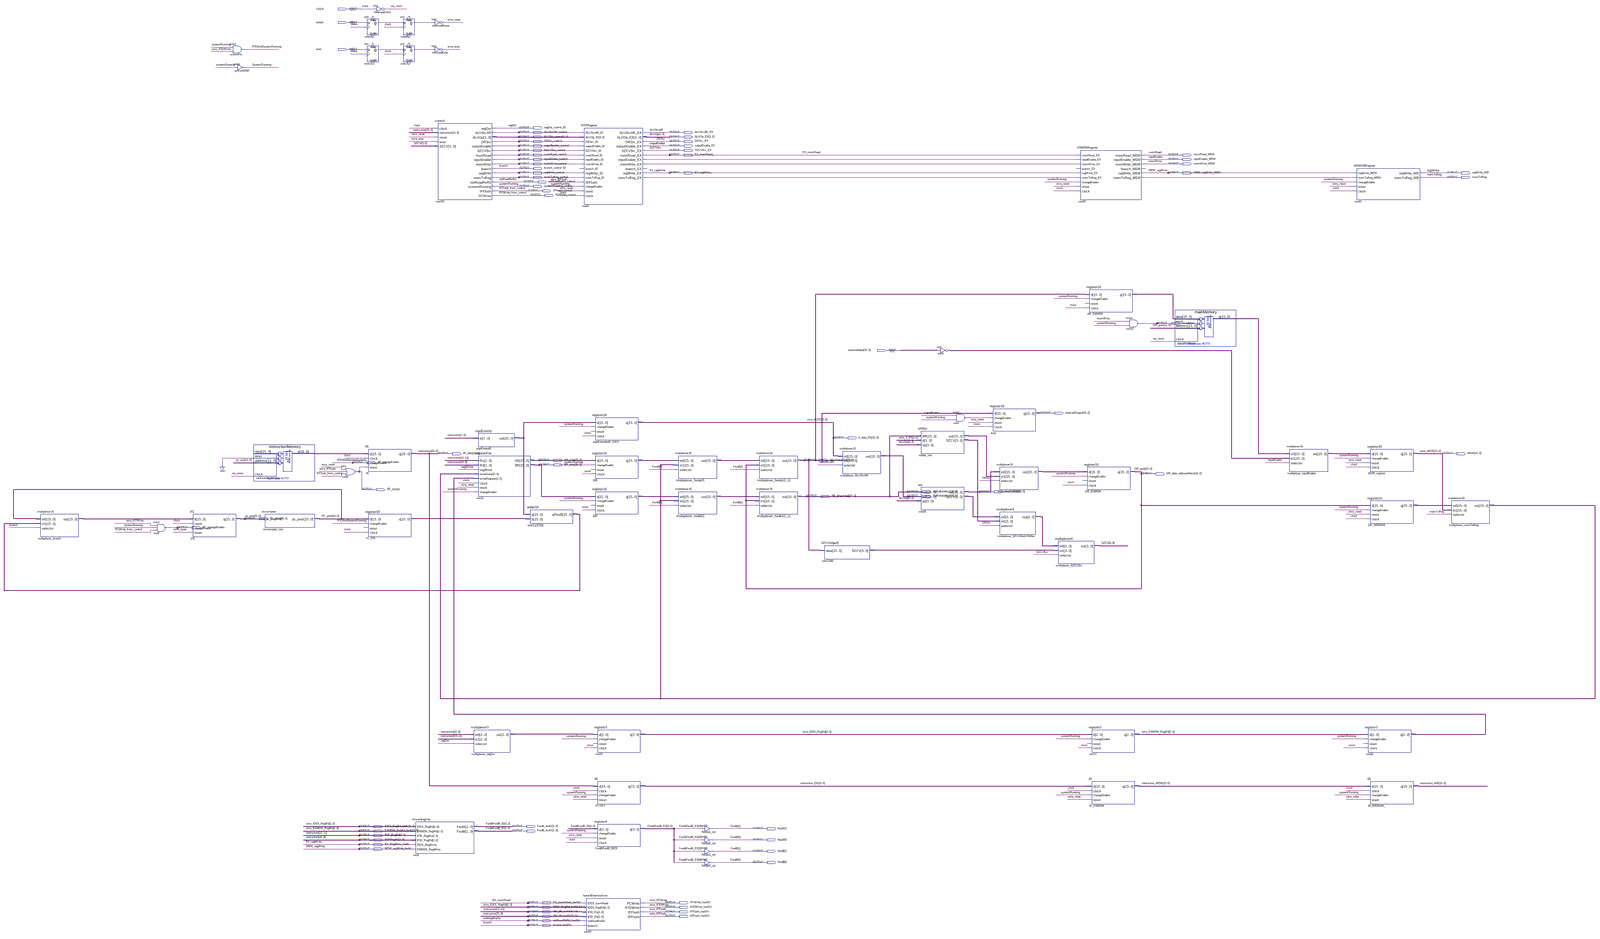
[diagram p0: schematic sheet, whole]
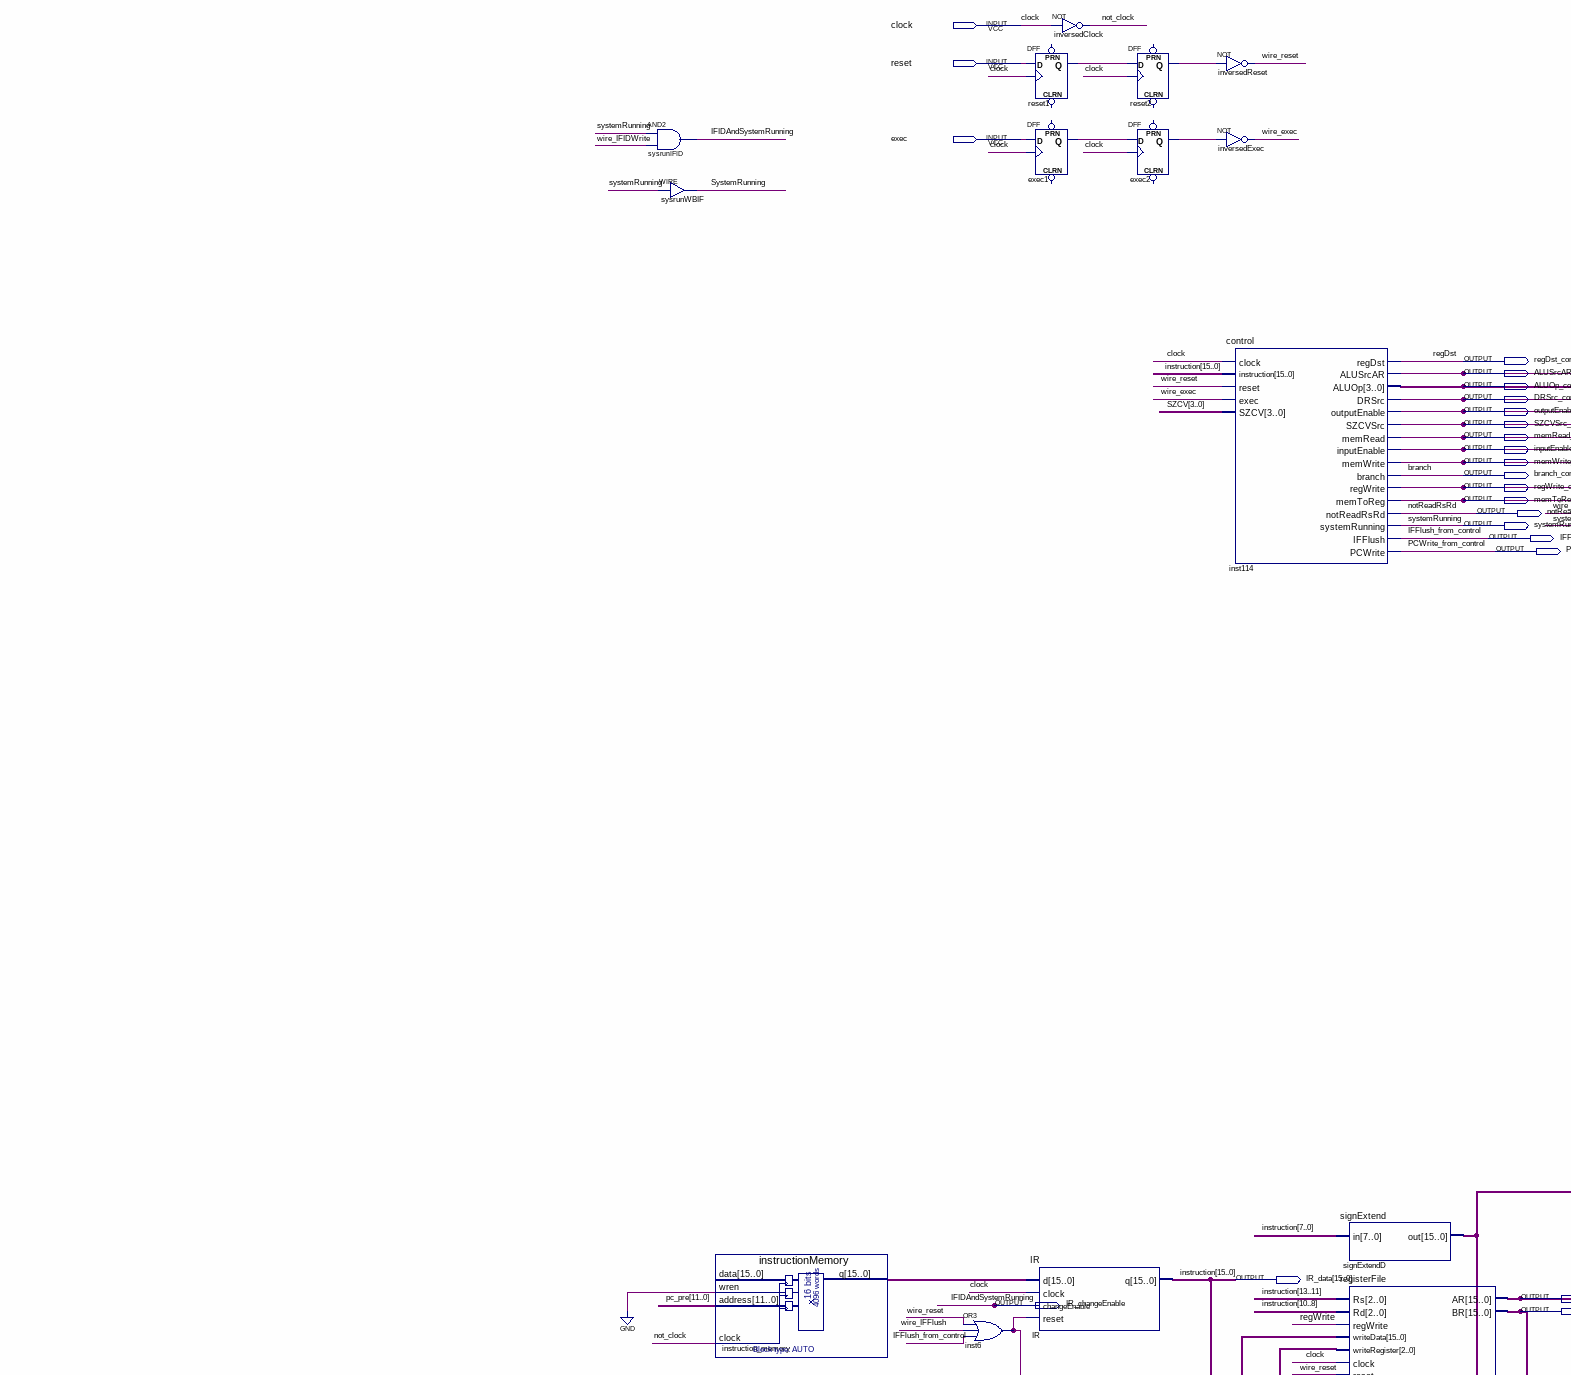
[diagram p1: schematic sheet, upper left part]
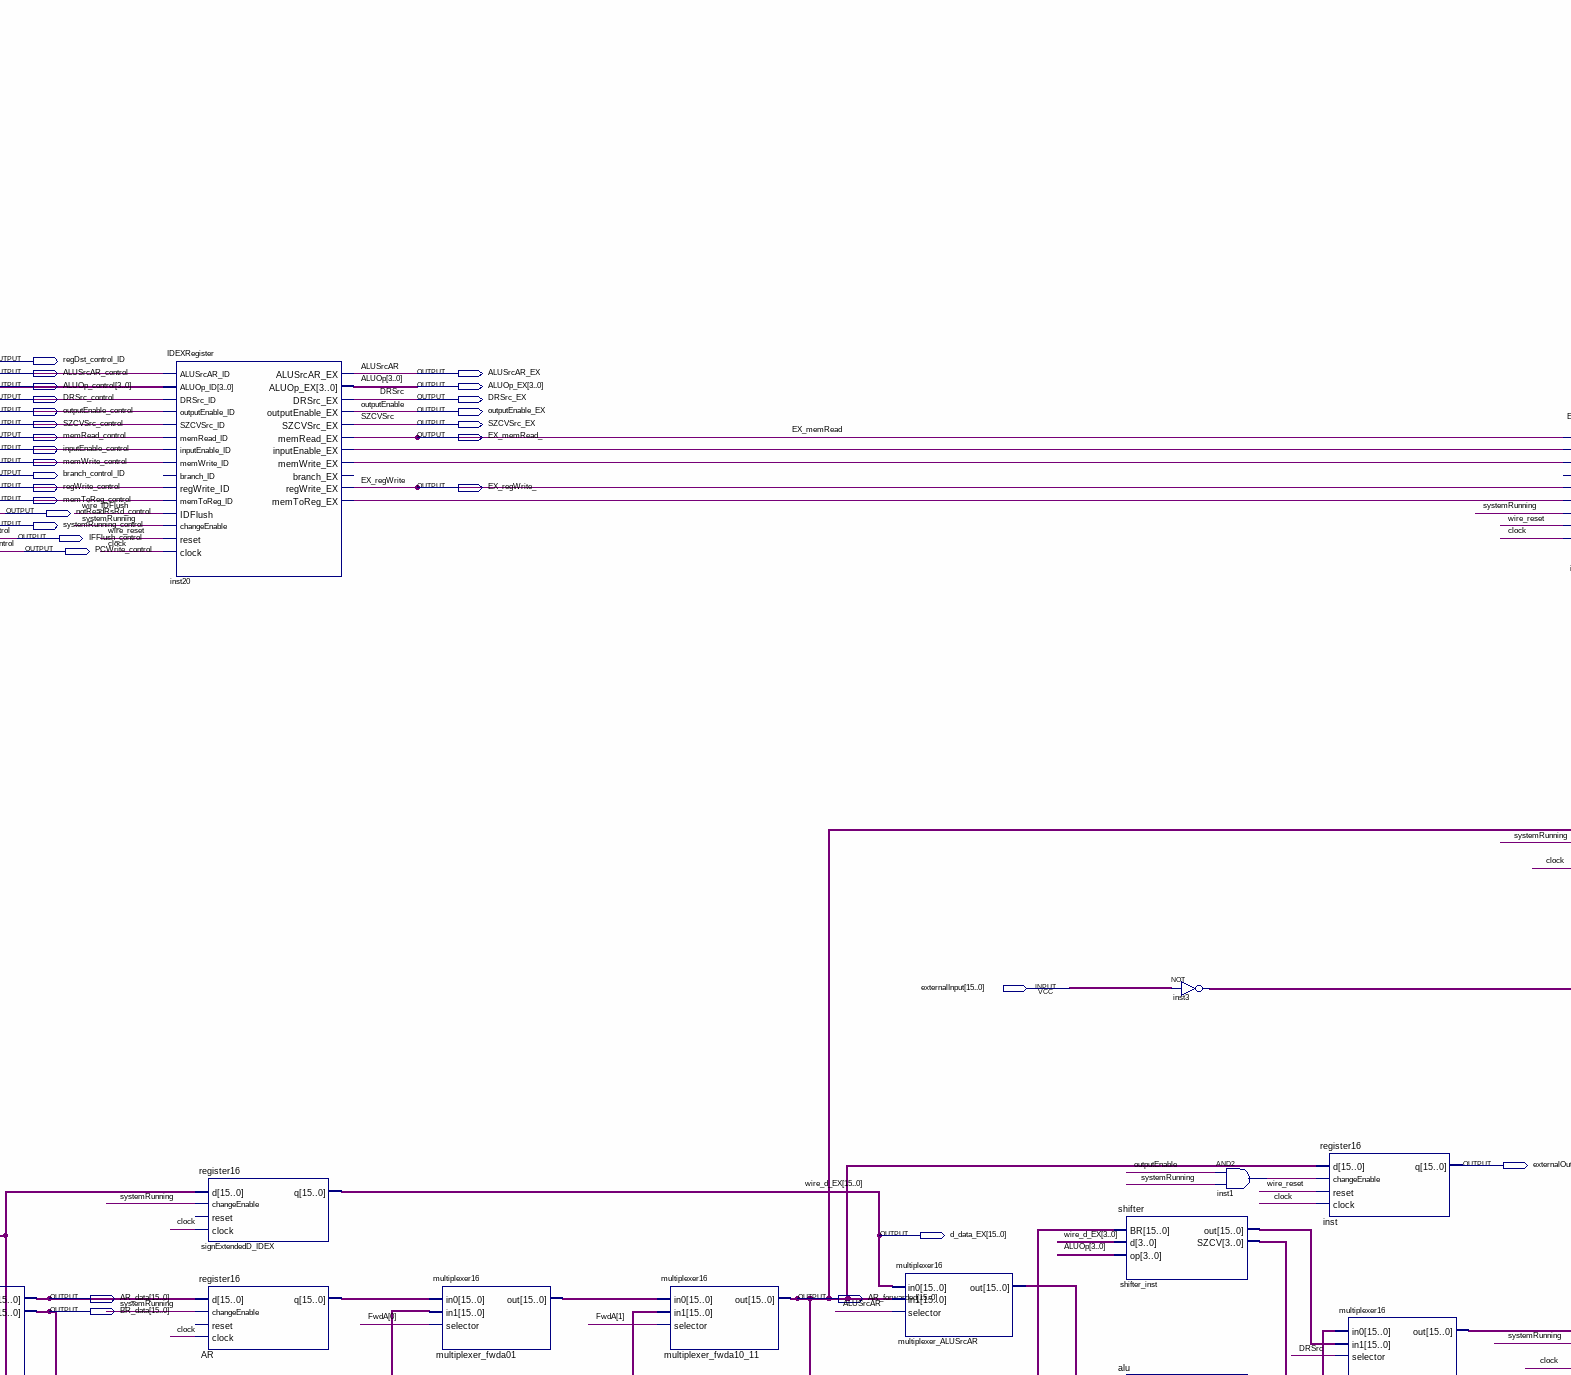
[diagram p2: schematic sheet, upper centre part]
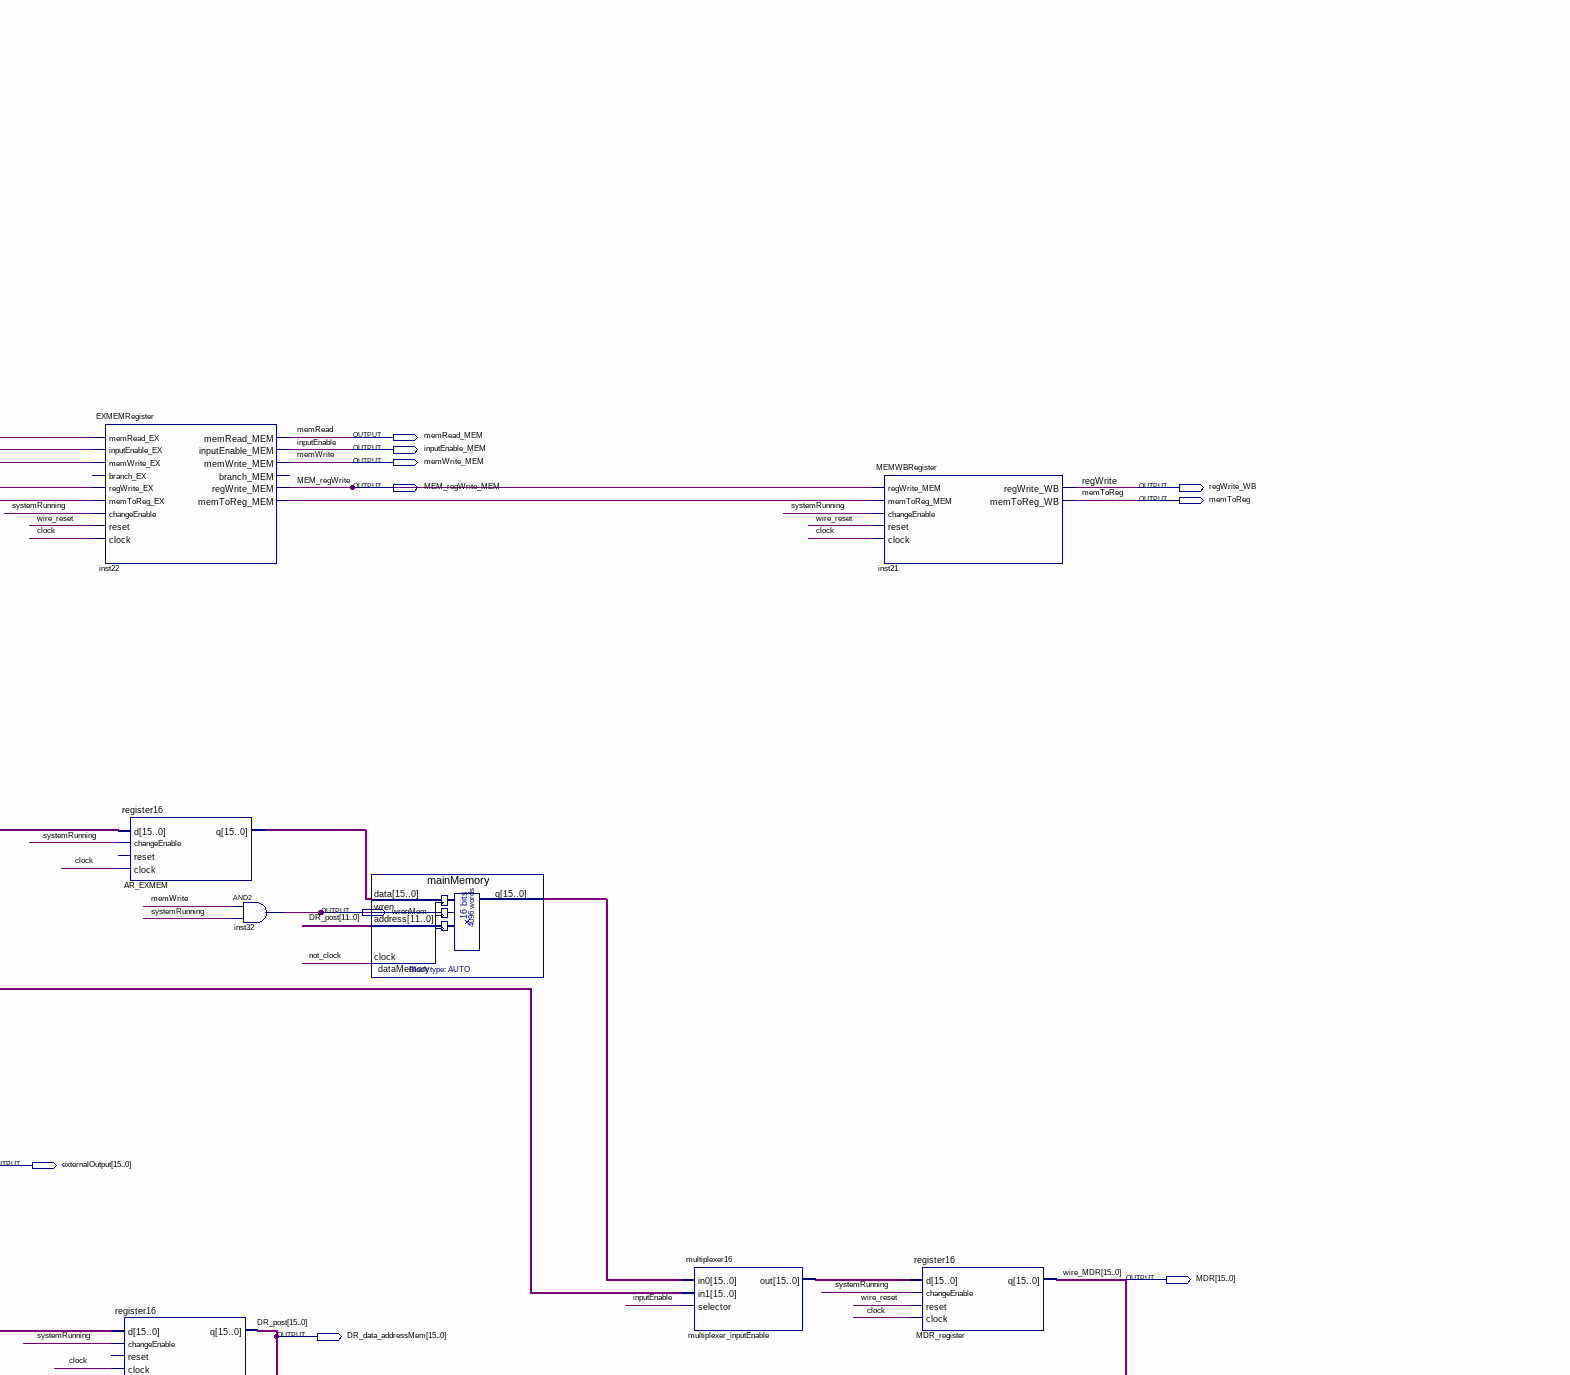
[diagram p3: schematic sheet, upper right part]
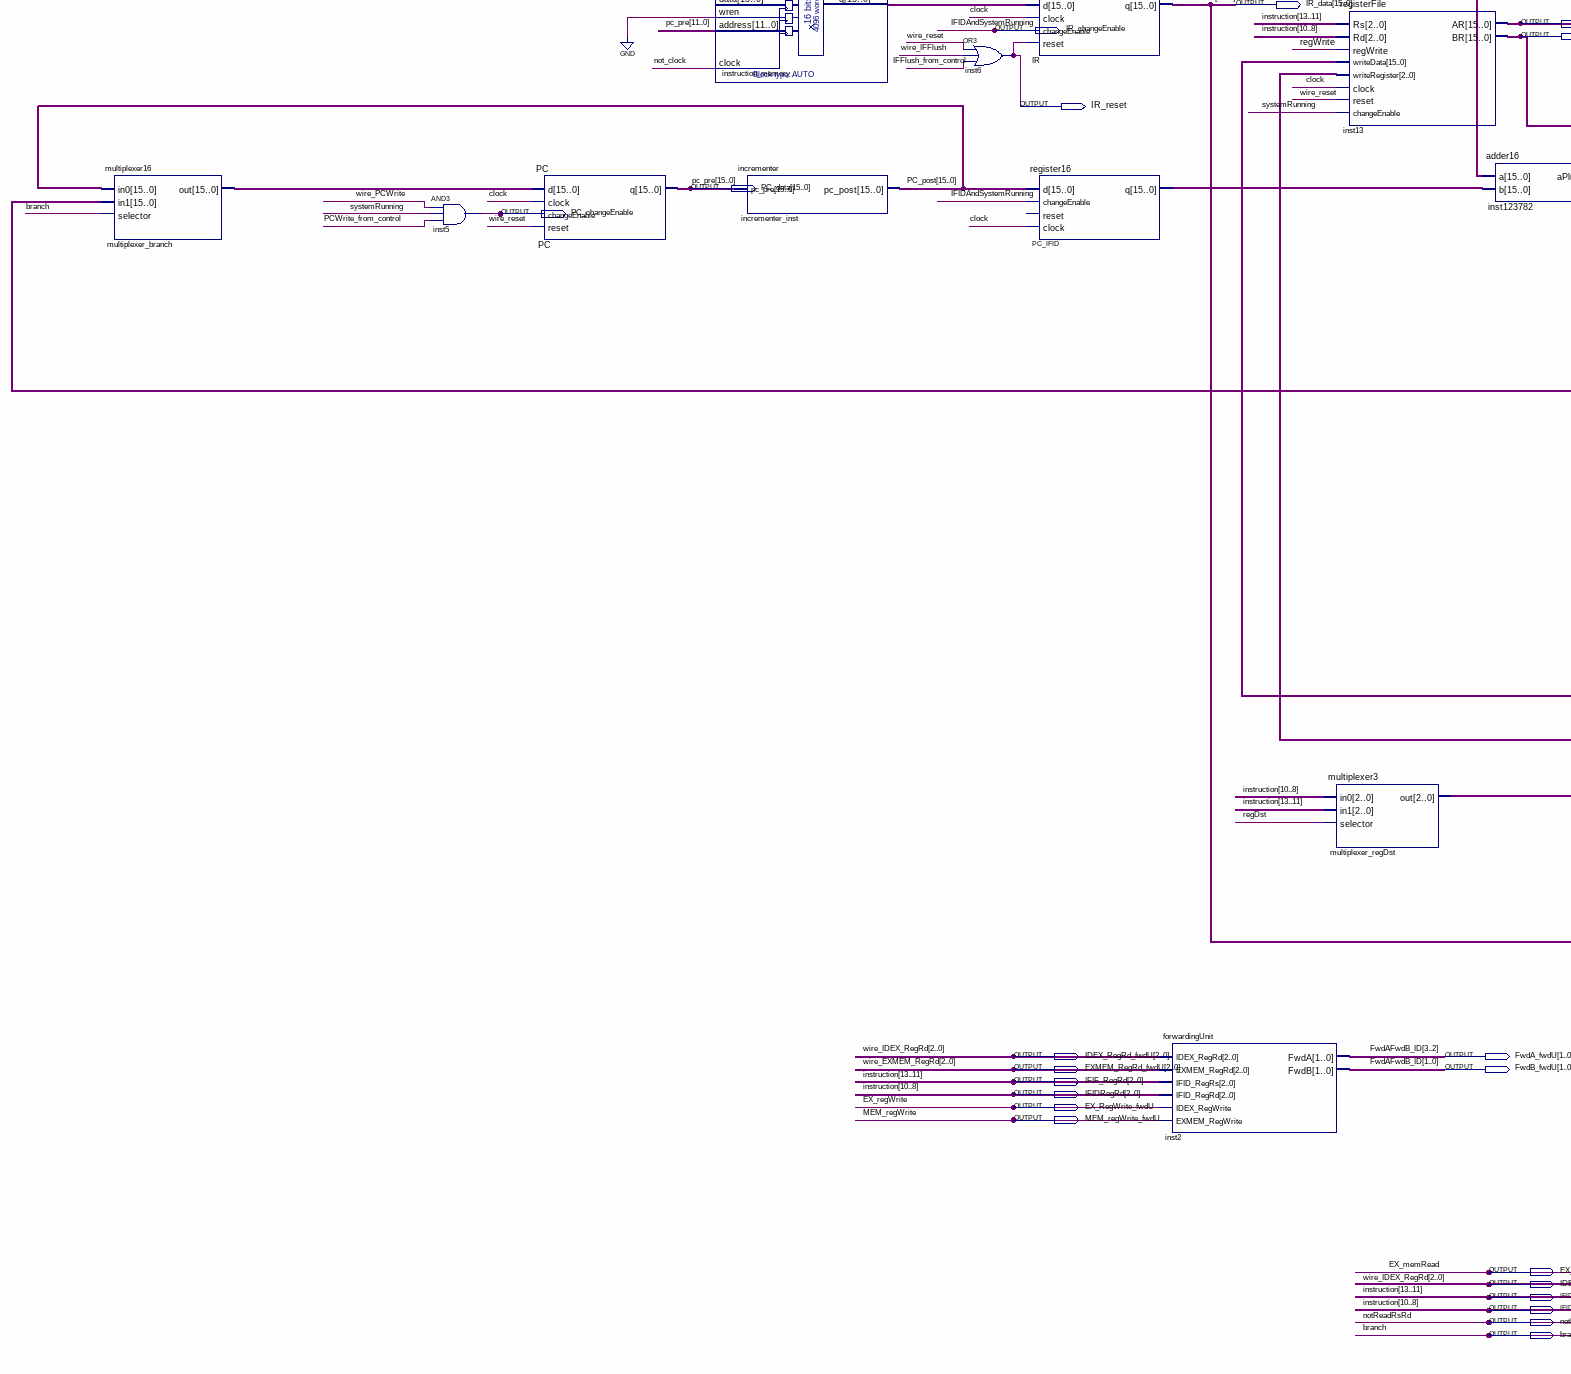
[diagram p4: schematic sheet, lower left part]
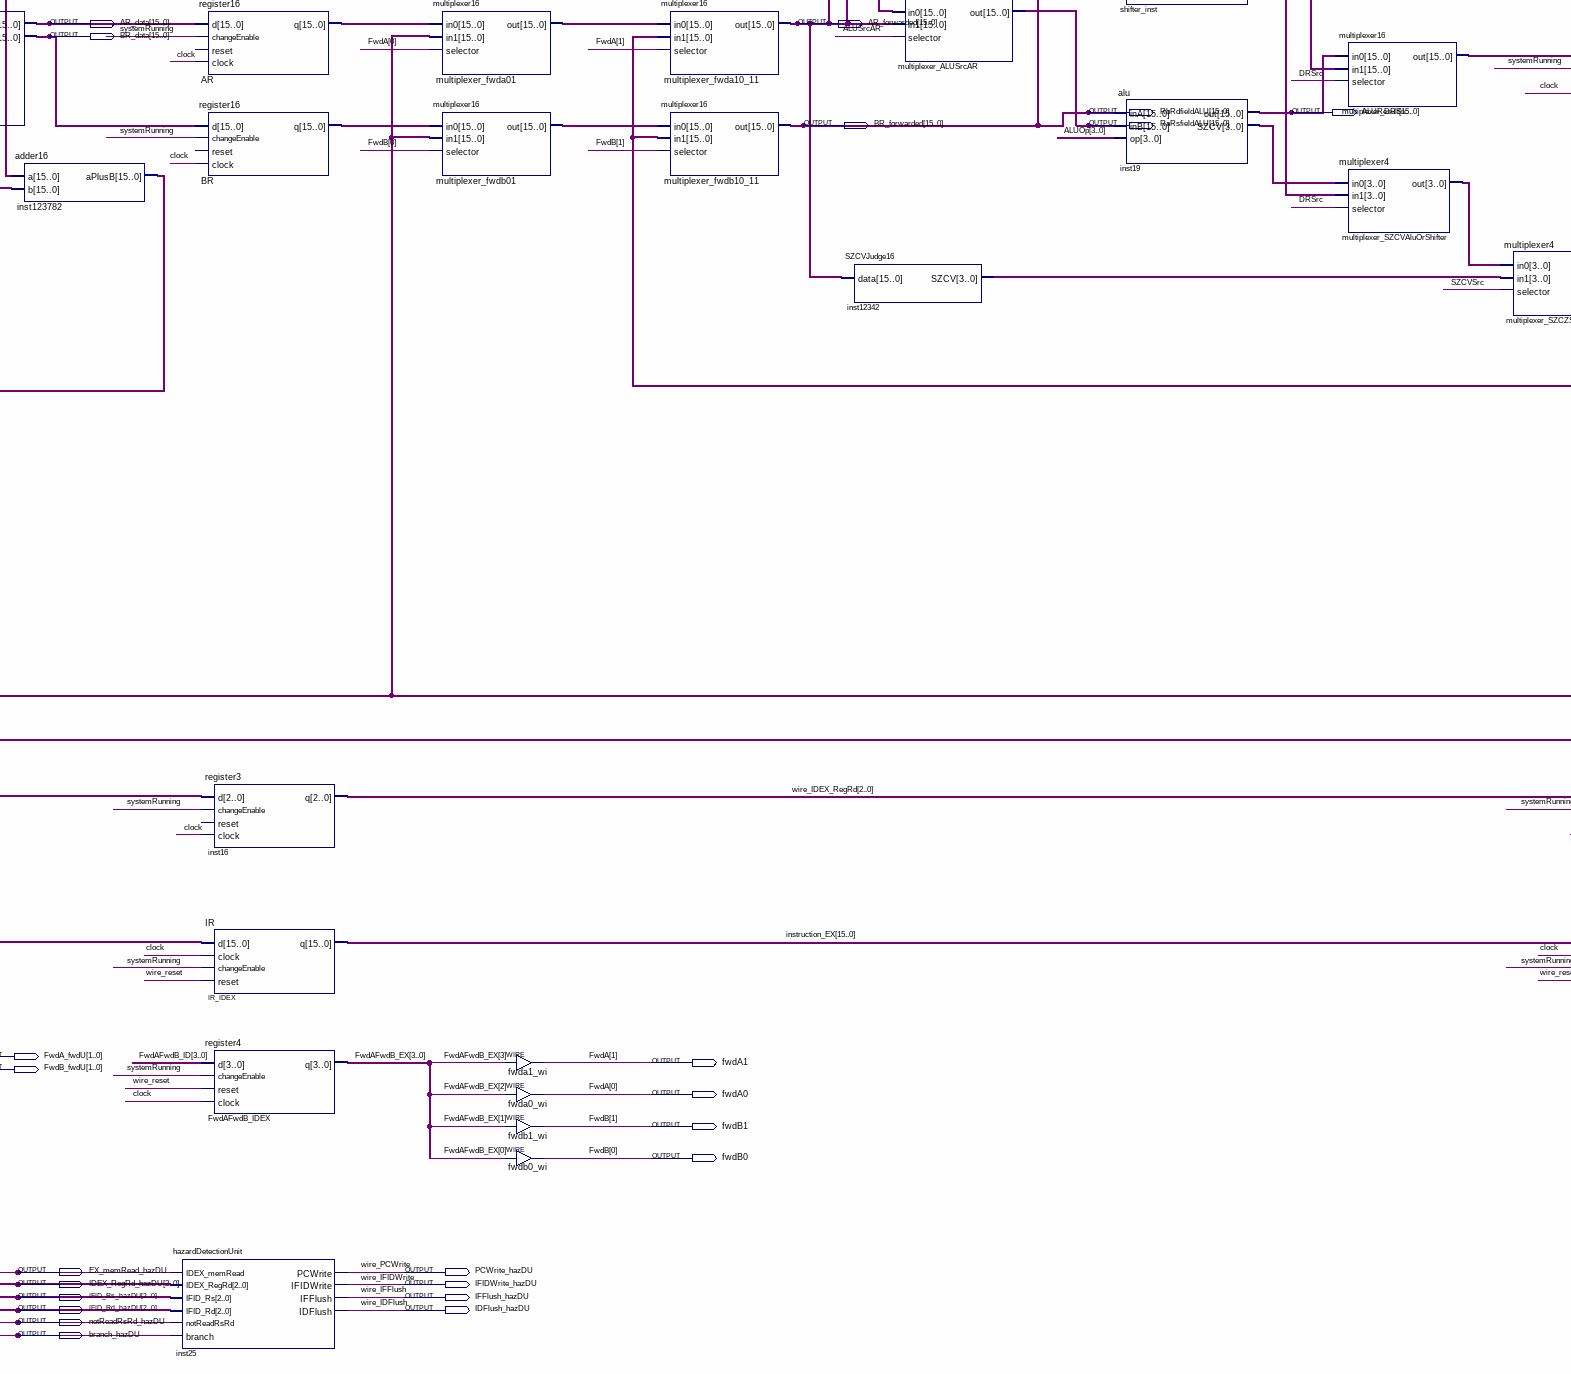
[diagram p5: schematic sheet, lower centre part]
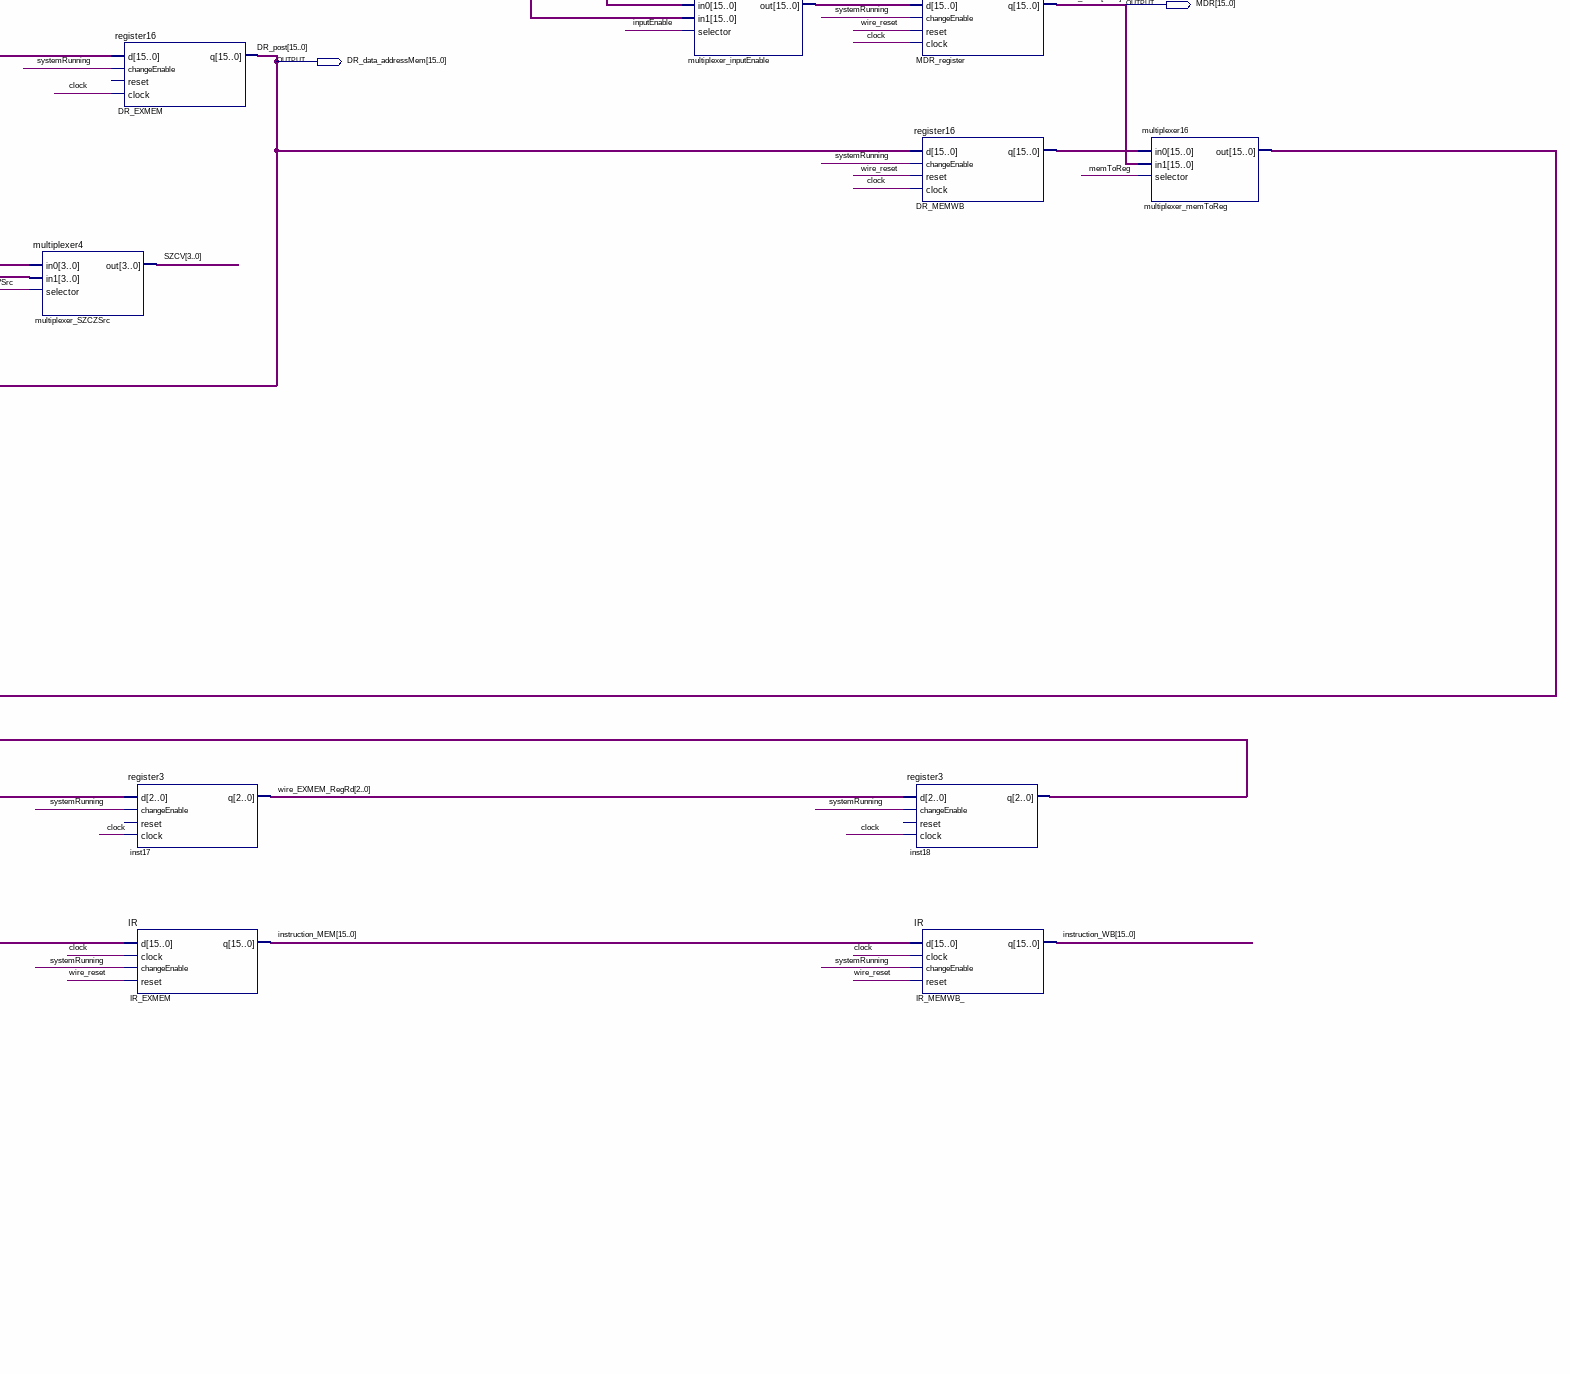
[diagram p6: schematic sheet, lower right part]
// Quartus schematic processor.bdf as structural Verilog: 63 symbols, 72 pins
module processor (
  input  clock,
  input  reset,
  input  exec,
  input  [15:0] externalInput,
  output regDst_control_ID,
  output ALUSrcAR_control,
  output ALUSrcAR_EX,
  output [3:0] ALUOp_control,
  output [3:0] ALUOp_EX,
  output DRSrc_control,
  output DRSrc_EX,
  output outputEnable_control,
  output outputEnable_EX,
  output SZCVSrc_control,
  output SZCVSrc_EX,
  output memRead_control,
  output EX_memRead_,
  output memRead_MEM,
  output inputEnable_control,
  output inputEnable_MEM,
  output memWrite_control,
  output memWrite_MEM,
  output branch_control_ID,
  output regWrite_control,
  output EX_regWrite_,
  output MEM_regWrite_MEM,
  output regWrite_WB,
  output memToReg_control,
  output memToReg,
  output notReadRsRd_control,
  output systemRunning_control,
  output IFFlush_control,
  output PCWrite_control,
  output wrenMem,
  output [15:0] externalOutput,
  output [15:0] d_data_EX,
  output [15:0] IR_data,
  output [15:0] MDR,
  output [15:0] AR_data,
  output [15:0] AR_forwarded,
  output IR_changeEnable,
  output [15:0] BR_data,
  output [15:0] DR_data_addressMem,
  output IR_reset,
  output [15:0] RbRdfieldALU,
  output [15:0] ALUResult,
  output [15:0] BR_forwarded,
  output [15:0] RaRsfieldALU,
  output [15:0] PC_data,
  output PC_changeEnable,
  output [2:0] IDEX_RegRd_fwdU,
  output [1:0] FwdA_fwdU,
  output fwdA1,
  output [2:0] EXMEM_RegRd_fwdU,
  output [1:0] FwdB_fwdU,
  output [2:0] IFIF_RegRd,
  output [2:0] IFIDRegRd,
  output fwdA0,
  output EX_RegWrite_fwdU,
  output MEM_regWrite_fwdU,
  output fwdB1,
  output fwdB0,
  output EX_memRead_hazDU,
  output PCWrite_hazDU,
  output [2:0] IDEX_RegRd_hazDU,
  output IFIDWrite_hazDU,
  output [2:0] IFID_Rs_hazDU,
  output IFFlush_hazDU,
  output [2:0] IFID_Rd_hazDU,
  output IDFlush_hazDU,
  output notReadRsRd_hazDU,
  output branch_hazDU
);

  wire exec1_q, exec2_q, inst1_out, inst20_inputenable_ex, inst20_memtoreg_ex, inst20_memwrite_ex,
       inst22_memtoreg_mem, not_clock, reset1_q, reset2_q, wire_exec, wire_reset;
  wire [2:0] inst18_q, multiplexer_regDst_out;
  wire [3:0] FwdAFwdB_EX, inst19_szcv, inst12342_szcv, multiplexer_SZCVAluOrShifter_out, shifter_inst_szcv,
       SZCV;
  wire [15:0] AR_EXMEM_q, AR_q, BR_q, dataMemory_q, DR_MEMWB_q, inst3_out, inst123782_aplusb, instruction_EX,
       instruction_MEM, instruction_memory_q, instruction_WB, multiplexer_branch_out, multiplexer_DRSrc_out,
       multiplexer_fwda01_out, multiplexer_fwdb01_out, multiplexer_inputEnable_out, multiplexer_memToReg_out,
       PC_IFID_q, PC_post, shifter_inst_out, signExtendD_out;

  multiplexer16 multiplexer_branch (
    .in0(PC_post), .in1(inst123782_aplusb), .selector(branch_control_ID), .out(multiplexer_branch_out));
  and inst5 (PC_changeEnable, PCWrite_hazDU, systemRunning_control, PCWrite_control);
  PC PC (.d(multiplexer_branch_out), .clock(clock), .changeEnable(PC_changeEnable), .reset(wire_reset), .q(PC_data));
  and sysrunIFID (IR_changeEnable, systemRunning_control, IFIDWrite_hazDU);
  assign systemRunning_control = systemRunning_control;  // WIRE sysrunWBIF
  instructionMemory instruction_memory (
    .wren(1'b0), .address(PC_data[11:0]), .clock(not_clock), .q(instruction_memory_q));  // open: data
  incrementer incrementer_inst (.pc_pre(PC_data), .pc_post(PC_post));
  or inst6 (IR_reset, wire_reset, IFFlush_hazDU, IFFlush_control);
  not inversedClock (not_clock, clock);
  DFF reset1 (.CLK(clock), .D(reset), .Q(reset1_q));  // open: CLRN, PRN
  DFF exec1 (.CLK(clock), .D(exec), .Q(exec1_q));  // open: CLRN, PRN
  IR IR (
    .d(instruction_memory_q), .clock(clock), .changeEnable(IR_changeEnable), .reset(IR_reset),
    .q({IR_data[15:14], IFID_Rs_hazDU, IFID_Rd_hazDU, IR_data[7:0]}));
  register16 PC_IFID (.d(PC_post), .changeEnable(IR_changeEnable), .clock(clock), .q(PC_IFID_q));  // open: reset
  DFF reset2 (.CLK(clock), .D(reset1_q), .Q(reset2_q));  // open: CLRN, PRN
  DFF exec2 (.CLK(clock), .D(exec1_q), .Q(exec2_q));  // open: CLRN, PRN
  forwardingUnit inst2 (
    .IDEX_RegRd(IDEX_RegRd_fwdU), .EXMEM_RegRd(EXMEM_RegRd_fwdU), .IFID_RegRs(IFID_Rs_hazDU),
    .IFID_RegRd(IFID_Rd_hazDU), .IDEX_RegWrite(EX_regWrite_), .EXMEM_RegWrite(MEM_regWrite_fwdU),
    .FwdA(FwdA_fwdU), .FwdB(FwdB_fwdU));
  not inversedReset (wire_reset, reset2_q);
  not inversedExec (wire_exec, exec2_q);
  control inst114 (
    .clock(clock), .instruction({IR_data[15:14], IFID_Rs_hazDU, IFID_Rd_hazDU, IR_data[7:0]}),
    .reset(wire_reset), .exec(wire_exec), .SZCV(SZCV), .regDst(regDst_control_ID),
    .ALUSrcAR(ALUSrcAR_control), .ALUOp(ALUOp_control), .DRSrc(DRSrc_control),
    .outputEnable(outputEnable_control), .SZCVSrc(SZCVSrc_control), .memRead(memRead_control),
    .inputEnable(inputEnable_control), .memWrite(memWrite_control), .branch(branch_control_ID),
    .regWrite(regWrite_control), .memToReg(memToReg_control), .notReadRsRd(notReadRsRd_control),
    .systemRunning(systemRunning_control), .IFFlush(IFFlush_control), .PCWrite(PCWrite_control));
  multiplexer3 multiplexer_regDst (
    .in0(IFID_Rd_hazDU), .in1(IFID_Rs_hazDU), .selector(regDst_control_ID), .out(multiplexer_regDst_out));
  signExtend signExtendD (.in(IR_data[7:0]), .out(signExtendD_out));
  registerFile inst13 (
    .Rs(IFID_Rs_hazDU), .Rd(IFID_Rd_hazDU), .regWrite(regWrite_WB), .writeData(multiplexer_memToReg_out),
    .writeRegister(inst18_q), .clock(clock), .reset(wire_reset), .changeEnable(systemRunning_control),
    .AR(AR_data), .BR(BR_data));
  adder16 inst123782 (.a(signExtendD_out), .b(PC_IFID_q), .aPlusB(inst123782_aplusb));
  IDEXRegister inst20 (
    .ALUSrcAR_ID(ALUSrcAR_control), .ALUOp_ID(ALUOp_control), .DRSrc_ID(DRSrc_control),
    .outputEnable_ID(outputEnable_control), .SZCVSrc_ID(SZCVSrc_control), .memRead_ID(memRead_control),
    .inputEnable_ID(inputEnable_control), .memWrite_ID(memWrite_control), .regWrite_ID(regWrite_control),
    .memToReg_ID(memToReg_control), .IDFlush(IDFlush_hazDU), .changeEnable(systemRunning_control),
    .reset(wire_reset), .clock(clock), .ALUSrcAR_EX(ALUSrcAR_EX), .ALUOp_EX(ALUOp_EX), .DRSrc_EX(DRSrc_EX),
    .outputEnable_EX(outputEnable_EX), .SZCVSrc_EX(SZCVSrc_EX), .memRead_EX(EX_memRead_),
    .inputEnable_EX(inst20_inputenable_ex), .memWrite_EX(inst20_memwrite_ex), .regWrite_EX(EX_regWrite_),
    .memToReg_EX(inst20_memtoreg_ex));  // open: branch_ID, branch_EX
  register16 signExtendedD_IDEX (
    .d(signExtendD_out), .changeEnable(systemRunning_control), .clock(clock), .q(d_data_EX));  // open: reset
  register16 AR (.d(AR_data), .changeEnable(systemRunning_control), .clock(clock), .q(AR_q));  // open: reset
  register16 BR (.d(BR_data), .changeEnable(systemRunning_control), .clock(clock), .q(BR_q));  // open: reset
  register3 inst16 (
    .d(multiplexer_regDst_out), .changeEnable(systemRunning_control), .clock(clock), .q(IDEX_RegRd_fwdU));  // open: reset
  IR IR_IDEX (
    .d({IR_data[15:14], IFID_Rs_hazDU, IFID_Rd_hazDU, IR_data[7:0]}), .clock(clock),
    .changeEnable(systemRunning_control), .reset(wire_reset), .q(instruction_EX));
  register4 FwdAFwdB_IDEX (
    .d({FwdA_fwdU, FwdB_fwdU}), .changeEnable(systemRunning_control), .reset(wire_reset), .clock(clock),
    .q(FwdAFwdB_EX));
  hazardDetectionUnit inst25 (
    .IDEX_memRead(EX_memRead_), .IDEX_RegRd(IDEX_RegRd_fwdU), .IFID_Rs(IFID_Rs_hazDU),
    .IFID_Rd(IFID_Rd_hazDU), .notReadRsRd(notReadRsRd_control), .branch(branch_control_ID),
    .PCWrite(PCWrite_hazDU), .IFIDWrite(IFIDWrite_hazDU), .IFFlush(IFFlush_hazDU), .IDFlush(IDFlush_hazDU));
  multiplexer16 multiplexer_fwda01 (
    .in0(AR_q), .in1(multiplexer_memToReg_out), .selector(fwdA0), .out(multiplexer_fwda01_out));
  multiplexer16 multiplexer_fwdb01 (
    .in0(BR_q), .in1(multiplexer_memToReg_out), .selector(fwdB0), .out(multiplexer_fwdb01_out));
  assign fwdA1 = FwdAFwdB_EX[3];  // WIRE fwda1_wi
  assign fwdA0 = FwdAFwdB_EX[2];  // WIRE fwda0_wi
  assign fwdB1 = FwdAFwdB_EX[1];  // WIRE fwdb1_wi
  assign fwdB0 = FwdAFwdB_EX[0];  // WIRE fwdb0_wi
  multiplexer16 multiplexer_fwda10_11 (
    .in0(multiplexer_fwda01_out), .in1(DR_data_addressMem), .selector(fwdA1), .out(AR_forwarded));
  multiplexer16 multiplexer_fwdb10_11 (
    .in0(multiplexer_fwdb01_out), .in1(DR_data_addressMem), .selector(fwdB1), .out(BR_forwarded));
  SZCVJudge16 inst12342 (.data(AR_forwarded), .SZCV(inst12342_szcv));
  multiplexer16 multiplexer_ALUSrcAR (.in0(d_data_EX), .in1(AR_forwarded), .selector(ALUSrcAR_EX), .out(RaRsfieldALU));
  shifter shifter_inst (
    .BR(BR_forwarded), .d(d_data_EX[3:0]), .op(ALUOp_EX), .out(shifter_inst_out), .SZCV(shifter_inst_szcv));
  alu inst19 (.inA(BR_forwarded), .inB(RaRsfieldALU), .op(ALUOp_EX), .out(ALUResult), .SZCV(inst19_szcv));
  assign inst3_out = ~externalInput;  // NOT inst3, 16 bits wide
  and inst1 (inst1_out, outputEnable_EX, systemRunning_control);
  register16 inst (.d(AR_forwarded), .changeEnable(inst1_out), .reset(wire_reset), .clock(clock), .q(externalOutput));
  multiplexer16 multiplexer_DRSrc (
    .in0(ALUResult), .in1(shifter_inst_out), .selector(DRSrc_EX), .out(multiplexer_DRSrc_out));
  multiplexer4 multiplexer_SZCVAluOrShifter (
    .in0(inst19_szcv), .in1(shifter_inst_szcv), .selector(DRSrc_EX), .out(multiplexer_SZCVAluOrShifter_out));
  multiplexer4 multiplexer_SZCZSrc (
    .in0(multiplexer_SZCVAluOrShifter_out), .in1(inst12342_szcv), .selector(SZCVSrc_EX), .out(SZCV));
  EXMEMRegister inst22 (
    .memRead_EX(EX_memRead_), .inputEnable_EX(inst20_inputenable_ex), .memWrite_EX(inst20_memwrite_ex),
    .regWrite_EX(EX_regWrite_), .memToReg_EX(inst20_memtoreg_ex), .changeEnable(systemRunning_control),
    .reset(wire_reset), .clock(clock), .memRead_MEM(memRead_MEM), .inputEnable_MEM(inputEnable_MEM),
    .memWrite_MEM(memWrite_MEM), .regWrite_MEM(MEM_regWrite_fwdU), .memToReg_MEM(inst22_memtoreg_mem));  // open: branch_EX, branch_MEM
  register16 AR_EXMEM (
    .d(AR_forwarded), .changeEnable(systemRunning_control), .clock(clock), .q(AR_EXMEM_q));  // open: reset
  register16 DR_EXMEM (
    .d(multiplexer_DRSrc_out), .changeEnable(systemRunning_control), .clock(clock), .q(DR_data_addressMem));  // open: reset
  register3 inst17 (
    .d(IDEX_RegRd_fwdU), .changeEnable(systemRunning_control), .clock(clock), .q(EXMEM_RegRd_fwdU));  // open: reset
  IR IR_EXMEM (
    .d(instruction_EX), .clock(clock), .changeEnable(systemRunning_control), .reset(wire_reset),
    .q(instruction_MEM));
  and inst32 (wrenMem, memWrite_MEM, systemRunning_control);
  mainMemory dataMemory (
    .data(AR_EXMEM_q), .wren(wrenMem), .address(DR_data_addressMem[11:0]), .clock(not_clock), .q(dataMemory_q));
  multiplexer16 multiplexer_inputEnable (
    .in0(dataMemory_q), .in1(inst3_out), .selector(inputEnable_MEM), .out(multiplexer_inputEnable_out));
  MEMWBRegister inst21 (
    .regWrite_MEM(MEM_regWrite_fwdU), .memToReg_MEM(inst22_memtoreg_mem),
    .changeEnable(systemRunning_control), .reset(wire_reset), .clock(clock), .regWrite_WB(regWrite_WB),
    .memToReg_WB(memToReg));
  register16 MDR_register (
    .d(multiplexer_inputEnable_out), .changeEnable(systemRunning_control), .reset(wire_reset), .clock(clock),
    .q(MDR));
  register16 DR_MEMWB (
    .d(DR_data_addressMem), .changeEnable(systemRunning_control), .reset(wire_reset), .clock(clock),
    .q(DR_MEMWB_q));
  register3 inst18 (
    .d(EXMEM_RegRd_fwdU), .changeEnable(systemRunning_control), .clock(clock), .q(inst18_q));  // open: reset
  IR IR_MEMWB_ (
    .d(instruction_MEM), .clock(clock), .changeEnable(systemRunning_control), .reset(wire_reset),
    .q(instruction_WB));
  multiplexer16 multiplexer_memToReg (.in0(DR_MEMWB_q), .in1(MDR), .selector(memToReg), .out(multiplexer_memToReg_out));

  assign branch_hazDU = branch_control_ID;
  assign EX_memRead_hazDU = EX_memRead_;
  assign EX_RegWrite_fwdU = EX_regWrite_;
  assign IDEX_RegRd_hazDU = IDEX_RegRd_fwdU;
  assign IFIDRegRd = IFID_Rd_hazDU;
  assign IFIF_RegRd = IFID_Rs_hazDU;
  assign IR_data[13:8] = {IFID_Rs_hazDU, IFID_Rd_hazDU};
  assign MEM_regWrite_MEM = MEM_regWrite_fwdU;
  assign notReadRsRd_hazDU = notReadRsRd_control;
  assign RbRdfieldALU = BR_forwarded;

  // Other names for the same wires on the sheet: ALUOp[3:0] = ALUOp_EX; ALUSrcAR = ALUSrcAR_EX;
  //   branch = branch_control_ID; DR_post[15:0] = DR_data_addressMem; DRSrc = DRSrc_EX; EX_memRead = EX_memRead_;
  //   EX_regWrite = EX_regWrite_; FwdAFwdB_ID[3:0] = {FwdA_fwdU, FwdB_fwdU}; IFFlush_from_control = IFFlush_control;
  //   inputEnable = inputEnable_MEM; instruction[15:0] = {IR_data[15:14], IFID_Rs_hazDU, IFID_Rd_hazDU, IR_data[7:0]};
  //   IFIDAndSystemRunning = IR_changeEnable; wire_MDR[15:0] = MDR; MEM_regWrite = MEM_regWrite_fwdU;
  //   memRead = memRead_MEM; memWrite = memWrite_MEM; notReadRsRd = notReadRsRd_control;
  //   outputEnable = outputEnable_EX; pc_pre[15:0] = PC_data; PCWrite_from_control = PCWrite_control;
  //   regDst = regDst_control_ID; regWrite = regWrite_WB; systemRunning = systemRunning_control; SZCVSrc = SZCVSrc_EX;
  //   wire_d_EX[15:0] = d_data_EX; wire_EXMEM_RegRd[2:0] = EXMEM_RegRd_fwdU; wire_IDEX_RegRd[2:0] = IDEX_RegRd_fwdU;
  //   wire_IDFlush = IDFlush_hazDU; wire_IFFlush = IFFlush_hazDU; wire_IFIDWrite = IFIDWrite_hazDU;
  //   wire_PCWrite = PCWrite_hazDU
endmodule
